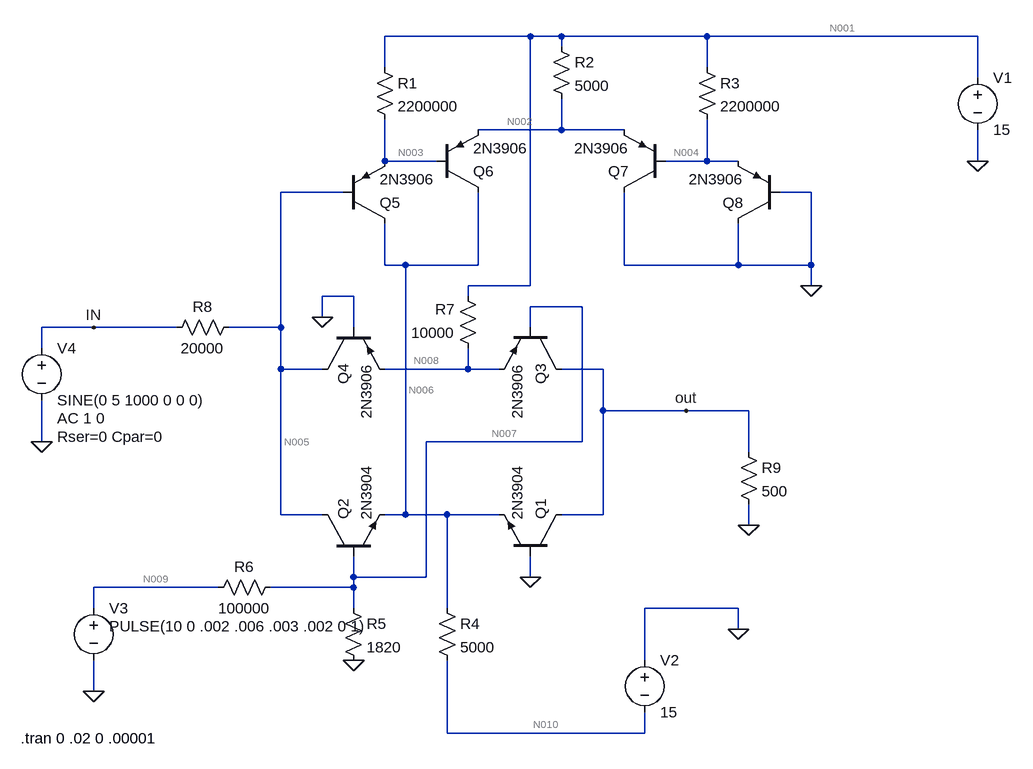
[diagram p0: schematic BMCELL.asc]
BMCELL.asc, the LTspice schematic file:
Version 4
SHEET 1 1292 680
WIRE 544 -528 320 -528
WIRE 592 -528 544 -528
WIRE 816 -528 592 -528
WIRE 1232 -528 816 -528
WIRE 592 -512 592 -528
WIRE 320 -480 320 -528
WIRE 816 -480 816 -528
WIRE 1232 -464 1232 -528
WIRE 592 -384 592 -432
WIRE 592 -384 464 -384
WIRE 688 -384 592 -384
WIRE 320 -336 320 -400
WIRE 400 -336 320 -336
WIRE 816 -336 816 -400
WIRE 816 -336 752 -336
WIRE 864 -336 816 -336
WIRE 1232 -336 1232 -384
WIRE 256 -288 160 -288
WIRE 976 -288 928 -288
WIRE 320 -176 320 -240
WIRE 352 -176 320 -176
WIRE 464 -176 464 -288
WIRE 464 -176 352 -176
WIRE 688 -176 688 -288
WIRE 864 -176 864 -240
WIRE 864 -176 688 -176
WIRE 976 -176 976 -288
WIRE 976 -176 864 -176
WIRE 544 -144 544 -528
WIRE 544 -144 448 -144
WIRE 976 -144 976 -176
WIRE 272 -128 224 -128
WIRE 448 -128 448 -144
WIRE 624 -112 544 -112
WIRE 224 -96 224 -128
WIRE -128 -80 -208 -80
WIRE 0 -80 -128 -80
WIRE 160 -80 160 -288
WIRE 160 -80 80 -80
WIRE 272 -80 272 -128
WIRE 544 -80 544 -112
WIRE -208 -48 -208 -80
WIRE 160 -16 160 -80
WIRE 224 -16 160 -16
WIRE 448 -16 448 -48
WIRE 448 -16 320 -16
WIRE 496 -16 448 -16
WIRE 656 -16 592 -16
WIRE 656 48 656 -16
WIRE 784 48 656 48
WIRE 880 48 784 48
WIRE -208 96 -208 32
WIRE 624 96 624 -112
WIRE 624 96 384 96
WIRE 880 112 880 48
WIRE 160 208 160 -16
WIRE 224 208 160 208
WIRE 352 208 352 -176
WIRE 352 208 320 208
WIRE 416 208 352 208
WIRE 496 208 416 208
WIRE 656 208 656 48
WIRE 656 208 592 208
WIRE 880 224 880 192
WIRE 272 304 272 272
WIRE 384 304 384 96
WIRE 384 304 272 304
WIRE 544 304 544 272
WIRE 64 320 -128 320
WIRE 272 320 272 304
WIRE 272 320 144 320
WIRE -128 352 -128 320
WIRE 272 352 272 320
WIRE 416 352 416 208
WIRE 864 352 720 352
WIRE 864 384 864 352
WIRE 720 432 720 352
WIRE -128 480 -128 432
WIRE 416 544 416 432
WIRE 720 544 720 512
WIRE 720 544 416 544
FLAG 976 -144 0
FLAG 272 432 0
FLAG 224 -96 0
FLAG 544 304 0
FLAG 880 224 0
FLAG -208 96 0
FLAG -128 480 0
FLAG 864 384 0
FLAG 1232 -336 0
FLAG -128 -80 IN
FLAG 784 48 out
SYMBOL npn 592 272 M270
SYMATTR InstName Q1
SYMATTR Value 2N3904
SYMBOL npn 224 272 R270
SYMATTR InstName Q2
SYMATTR Value 2N3904
SYMBOL pnp 592 -80 R90
SYMATTR InstName Q3
SYMATTR Value 2N3906
SYMBOL pnp 224 -80 M90
SYMATTR InstName Q4
SYMATTR Value 2N3906
SYMBOL pnp 256 -240 M180
SYMATTR InstName Q5
SYMATTR Value 2N3906
SYMBOL pnp 400 -288 M180
SYMATTR InstName Q6
SYMATTR Value 2N3906
SYMBOL pnp 752 -288 R180
SYMATTR InstName Q7
SYMATTR Value 2N3906
SYMBOL pnp 928 -240 R180
SYMATTR InstName Q8
SYMATTR Value 2N3906
SYMBOL res 304 -496 R0
SYMATTR InstName R1
SYMATTR Value 2200000
SYMBOL res 576 -528 R0
SYMATTR InstName R2
SYMATTR Value 5000
SYMBOL res 800 -496 R0
SYMATTR InstName R3
SYMATTR Value 2200000
SYMBOL res 400 336 R0
SYMATTR InstName R4
SYMATTR Value 5000
SYMBOL res 256 336 R0
SYMATTR InstName R5
SYMATTR Value 1820
SYMBOL res 160 304 R90
WINDOW 0 0 56 VBottom 2
WINDOW 3 32 56 VTop 2
SYMATTR InstName R6
SYMATTR Value 100000
SYMBOL res 464 -32 R180
WINDOW 0 36 76 Left 2
WINDOW 3 36 40 Left 2
SYMATTR InstName R7
SYMATTR Value 10000
SYMBOL res 96 -96 R90
WINDOW 0 0 56 VBottom 2
WINDOW 3 32 56 VTop 2
SYMATTR InstName R8
SYMATTR Value 20000
SYMBOL res 864 96 R0
SYMATTR InstName R9
SYMATTR Value 500
SYMBOL voltage 1232 -480 R0
WINDOW 123 0 0 Left 2
WINDOW 39 0 0 Left 2
SYMATTR InstName V1
SYMATTR Value 15
SYMBOL voltage 720 416 R0
WINDOW 123 0 0 Left 2
WINDOW 39 0 0 Left 2
SYMATTR InstName V2
SYMATTR Value 15
SYMBOL voltage -128 336 R0
WINDOW 123 0 0 Left 2
WINDOW 39 0 0 Left 2
WINDOW 3 24 44 Left 2
SYMATTR Value PULSE(10 0 .002 .006 .003 .002 0 1)
SYMATTR InstName V3
SYMBOL voltage -208 -64 R0
WINDOW 123 24 124 Left 2
WINDOW 39 24 152 Left 2
SYMATTR Value2 AC 1 0
SYMATTR SpiceLine Rser=0 Cpar=0
SYMATTR InstName V4
SYMATTR Value SINE(0 5 1000 0 0 0)
TEXT -240 552 Left 2 !.tran 0 .02 0 .00001

The netlist it stands for:
* BMCELL.asc
Q1 out 0 N006 0 2N3904
Q2 N005 N007 N006 0 2N3904
Q3 out N007 N008 0 2N3906
Q4 N005 0 N008 0 2N3906
Q5 N006 N005 N003 0 2N3906
Q6 N006 N003 N002 0 2N3906
Q7 0 N004 N002 0 2N3906
Q8 0 0 N004 0 2N3906
R1 N001 N003 2200000
R2 N001 N002 5000
R3 N001 N004 2200000
R4 N006 N010 5000
R5 N007 0 1820
R6 N007 N009 100000
R7 N008 N001 10000
R8 N005 IN 20000
R9 out 0 500
V1 N001 0 15
V2 0 N010 15
V3 N009 0 PULSE(10 0 .002 .006 .003 .002 0 1)
V4 IN 0 SINE(0 5 1000 0 0 0) AC 1 0 Rser=0 Cpar=0
.model NPN NPN
.model PNP PNP
.lib standard.bjt
.tran 0 .02 0 .00001
.backanno
.end

* Results of the author's LTspice run, read from the files saved beside the schematic
* Operating Point, zero values left out:
*   V(out) = 1.539 µV
*   V(n006) = -494.4 mV
*   V(n005) = -4.474 mV
*   V(n007) = 170.2 mV
*   V(n008) = 664.6 mV
*   V(n003) = 539.6 mV
*   V(n002) = 1.205 V
*   V(n004) = 542.7 mV
*   V(n001) = 15 V
*   V(n010) = -15 V
*   V(n009) = 10 V
*   Ic(Q8) = -12.94 µA
*   Ib(Q8) = -64.7 nA
*   Ie(Q8) = 13 µA
*   Ic(Q7) = -1.289 mA
*   Ib(Q7) = -6.433 µA
*   Ie(Q7) = 1.296 mA
*   Ic(Q6) = -1.456 mA
*   Ib(Q6) = -7.231 µA
*   Ie(Q6) = 1.463 mA
*   Ic(Q5) = -13.74 µA
*   Ib(Q5) = -68.35 nA
*   Ie(Q5) = 13.8 µA
*   Ic(Q4) = -1.424 mA
*   Ib(Q4) = -7.147 µA
*   Ie(Q4) = 1.432 mA
*   Ic(Q3) = -2.006 µA
*   Ib(Q3) = -10.01 nA
*   Ie(Q3) = 2.016 µA
*   Ic(Q2) = 1.425 mA
*   Ib(Q2) = 4.774 µA
*   Ie(Q2) = -1.429 mA
*   Ic(Q1) = 2.003 µA
*   Ib(Q1) = 6.677 nA
*   Ie(Q1) = -2.01 µA
*   I(R9) = 3.077 nA
*   I(R8) = -223.7 nA
*   I(R7) = -1.434 mA
*   I(R6) = -98.3 µA
*   I(R5) = 93.53 µA
*   I(R4) = 2.901 mA
*   I(R3) = 6.572 µA
*   I(R2) = 2.759 mA
*   I(R1) = 6.573 µA
*   I(V4) = -223.7 nA
*   I(V3) = -98.3 µA
*   I(V2) = -2.901 mA
*   I(V1) = -4.206 mA
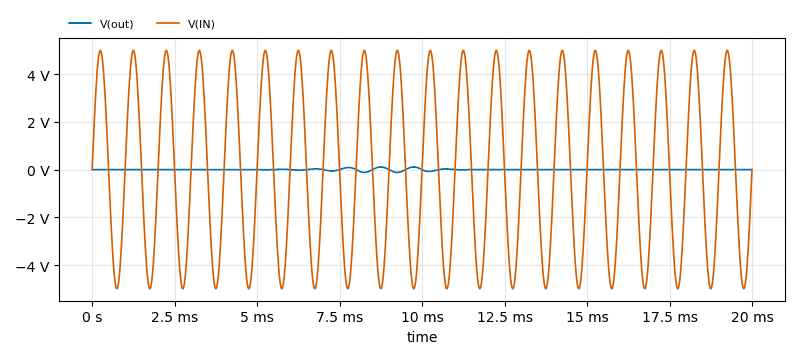
[diagram p1: Transient Analysis of BMCELL.asc, plotted from the saved traces]
* Transient Analysis, 1 run:
*   V(out): min -120.5 mV, max 109.8 mV, average -415.2 µV, rms 30.2 mV, last 1.525 µV
*   V(IN): min -4.994 V, max 4.994 V, average -13.2 µV, rms 3.531 V, last 0 V